# EasyEDA schematic keyboard-line.json
TITLE: Sheet_1; REV: 1.0; Date: 2020-08-25; Sheet: 1/1; Drawn By: dc65; Company: Your Company
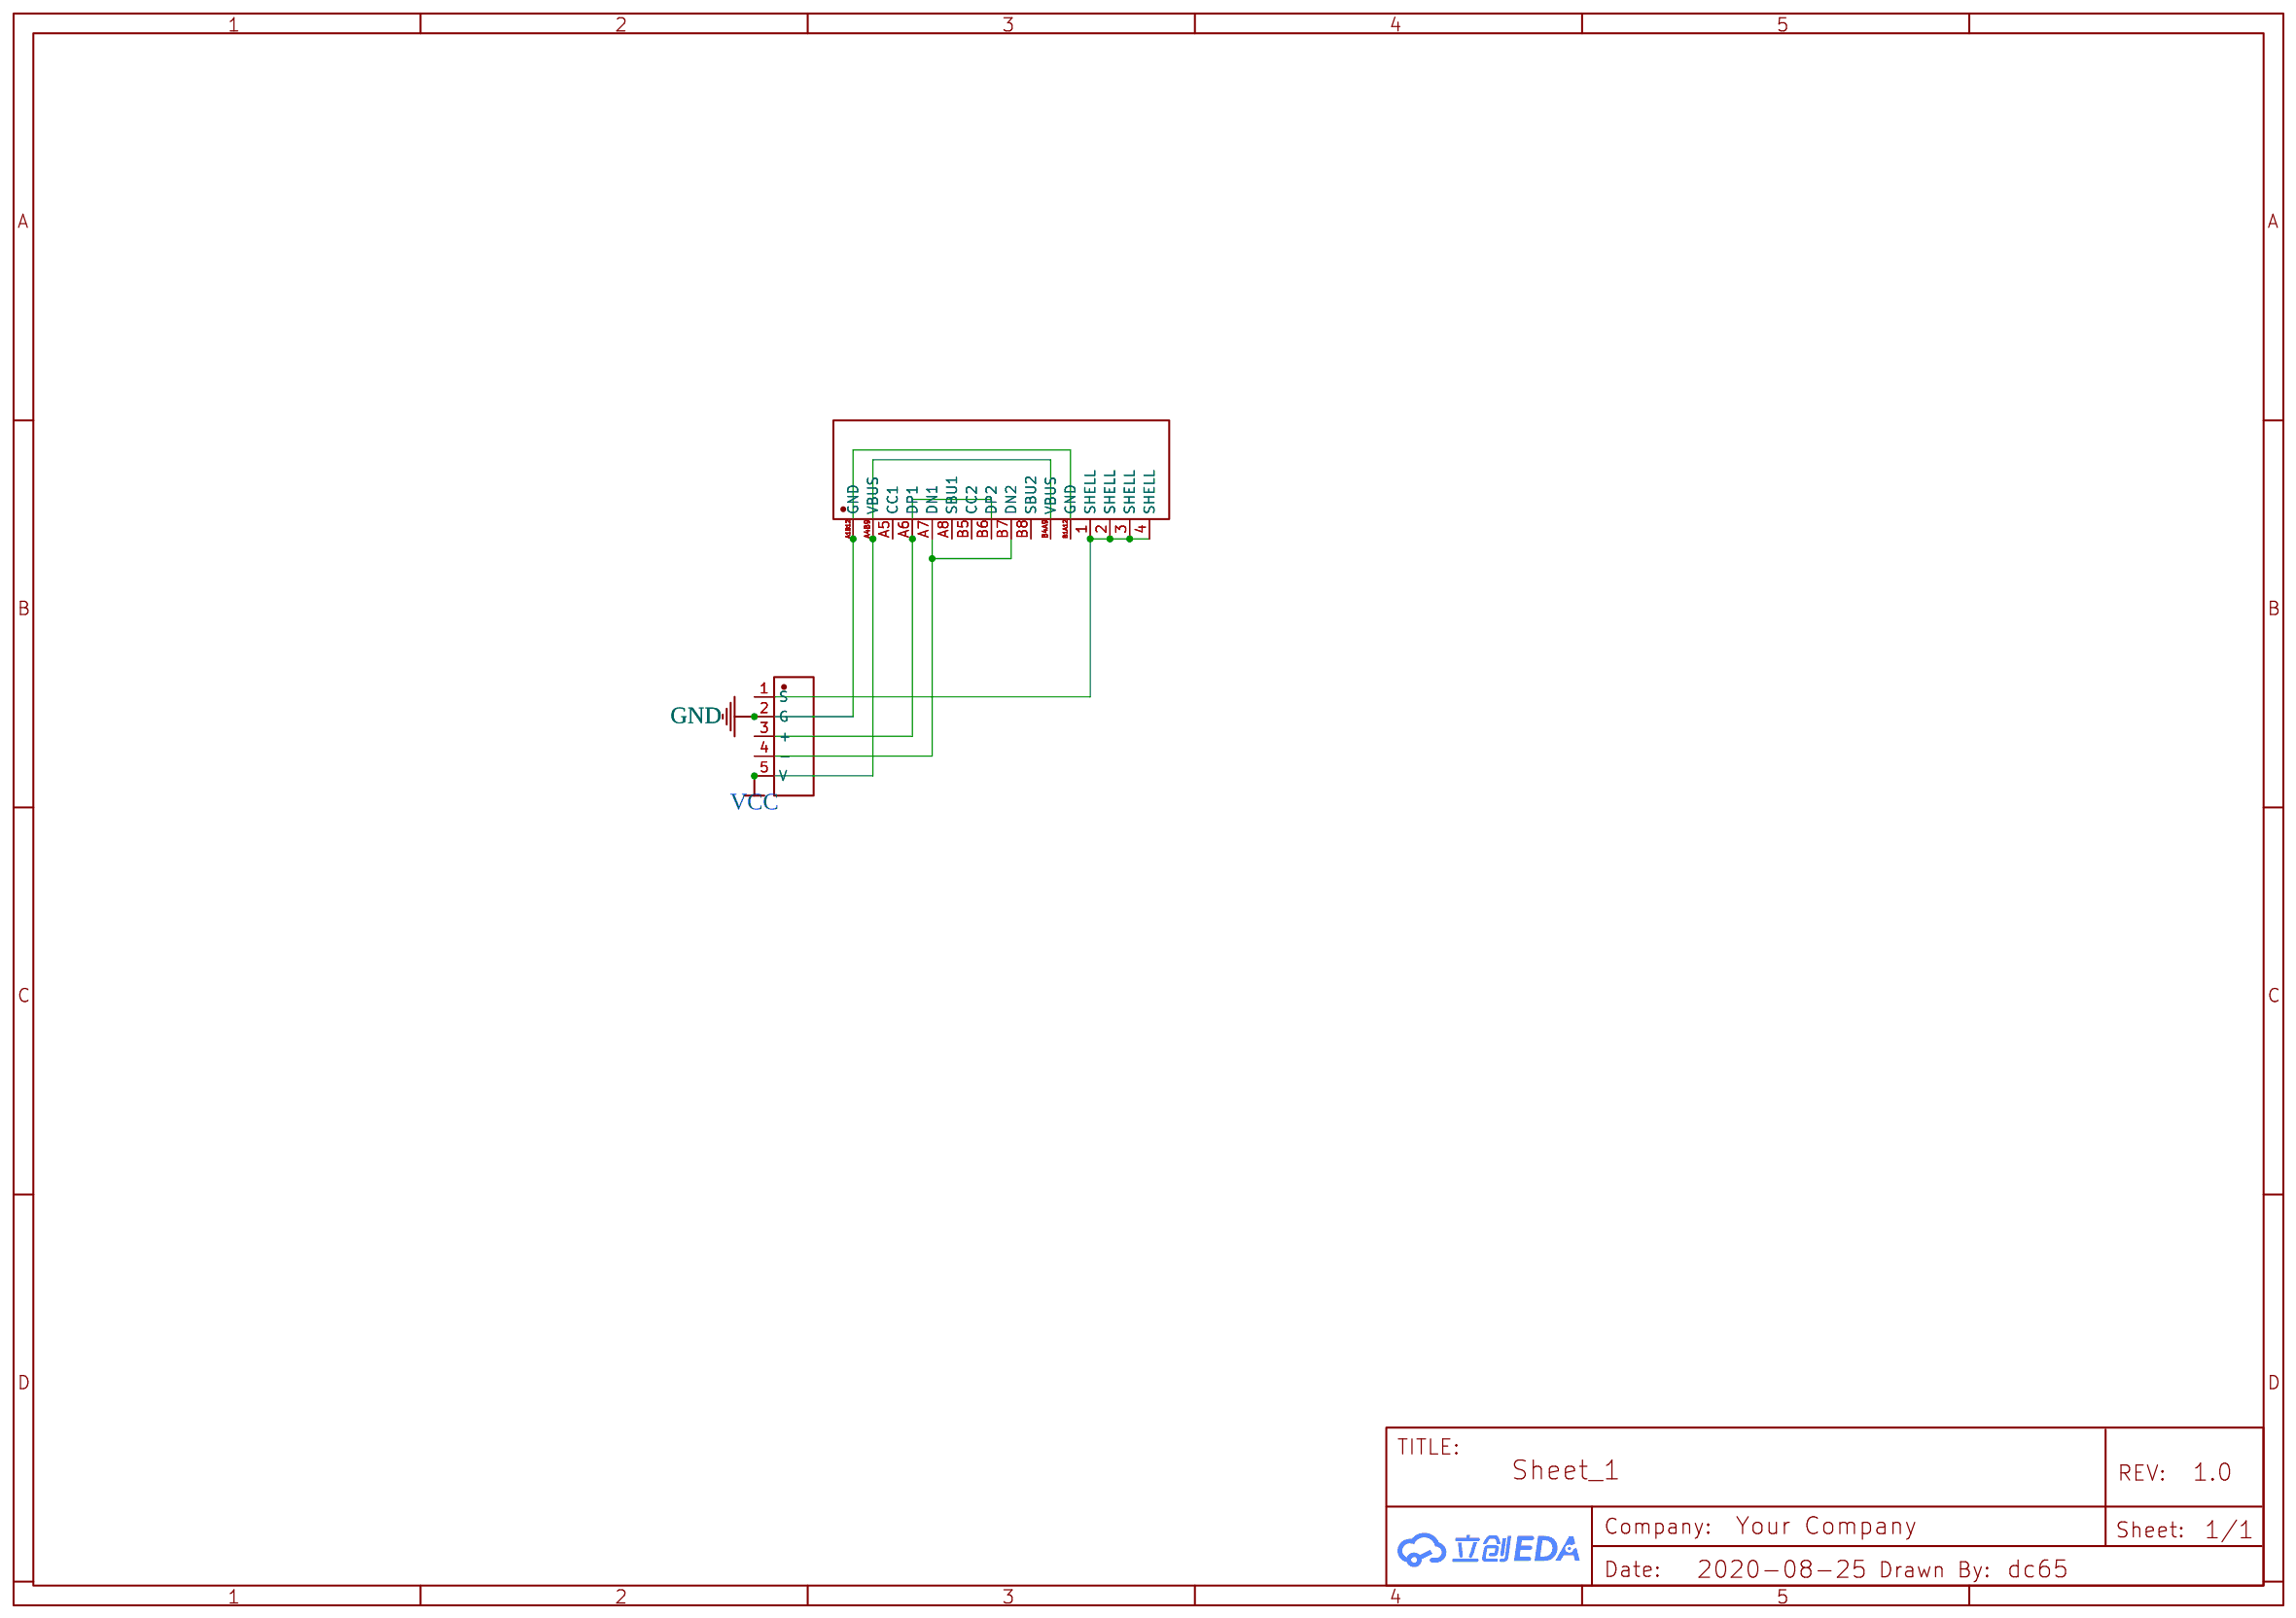
[diagram p0: schematic sheet]

## Parts
CN1  ph2.0-50-无丝印  [CONN-TH_A2008WR-5P-无丝印]
USB1  TYPE-C16PIN  [USB-C-SMD_TYPE-C16PIN]

## Library data of the parts
CN1 = ph2.0-50-无丝印: Supplier: LCSC; Supplier Part: C273103; Manufacturer: Changjiang Connectors; Manufacturer Part: A2008WR-5P; Contributor: dc65
USB1 = TYPE-C16PIN: Supplier: LCSC; Supplier Part: C393939; Manufacturer: SHOU HAN; Contributor: LCSC

## Nets
GND: CN1.2(G) USB1.A1B12(GND) USB1.B1A12(GND)
VCC: CN1.5(V) USB1.A4B9(VBUS) USB1.B4A9(VBUS)
Net-(CN1-1): CN1.1(S) USB1.1(SHELL) USB1.2(SHELL) USB1.3(SHELL) USB1.4(SHELL)
Net-(CN1-3): CN1.3(+) USB1.A6(DP1) USB1.B6(DP2)
Net-(CN1-4): CN1.4(-) USB1.A7(DN1) USB1.B7(DN2)

Not connected (* = marked no-connect by the designer): USB1 A5(CC1) A8(SBU1) B5(CC2) B8(SBU2)
